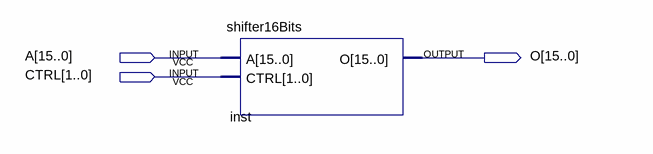
[diagram p0: schematic sheet]
// Quartus schematic main.bdf as structural Verilog: 1 symbols, 3 pins
module main (
  input  [15:0] A,
  input  [1:0] CTRL,
  output [15:0] O
);

  shifter16Bits inst (.A(A), .CTRL(CTRL), .O(O));
endmodule
